# Altium schematic sheet Current_Meas.SchDoc
size A4
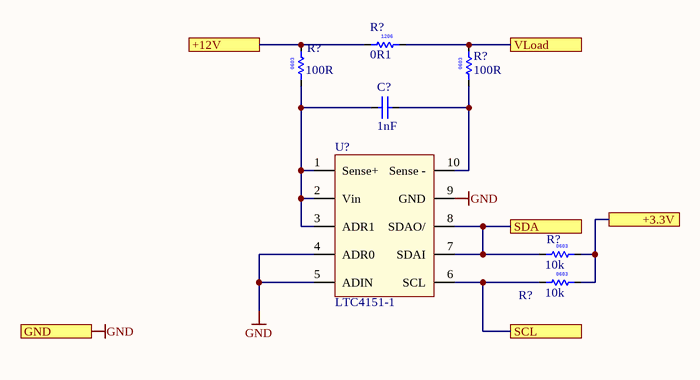
[diagram p0: Current_Meas.SchDoc]

## Parts
(Parts that share a designator on the sheet are numbered #1, #2 ... from top to bottom, then left to right.)
C?  1nF  [CAPC1608N]
R?#1  0R1  [RESC3216N]
R?#2  100R  [RESC1608N]
R?#3  100R  [RESC1608N]
R?#4  10k  [RESC1608N]
R?#5  10k  [RESC1608N]
U?  LTC4151-1  [MSOP_10]

## Ports
+3.3V, +12V, GND, SCL, SDA, VLoad

## Nets
GND: U?.4(ADR0) U?.5(ADIN) U?.9(GND) ; port GND
+3.3V: R?#4.2 R?#5.2 ; port +3.3V
+12V: R?#1.1 R?#2.2 ; port +12V
SCL: R?#5.1 U?.6(SCL) ; port SCL
SDA: R?#4.1 U?.7(SDAI) U?.8(SDAO/) ; port SDA
VLoad: R?#1.2 R?#3.2 ; port VLoad
NetC?_1: C?.1 R?#2.1 U?.1(Sense+) U?.2(Vin) U?.3(ADR1)
NetC?_2: C?.2 R?#3.1 U?.10(Sense_-)

## Notes on the sheet
- (in symbol R0000008) 0603
- (in symbol R0000023) 1206
- (in symbol R2406048) 0603

## Library data of the parts
C? = C0000004: MLCC, 1nF, 50V, 10%, X7R, 0603; Manufacturer: KEMET; Manufacturer Part Number: C0603C102K5RAC; Voltage: 50; Part Number: C0000004; Part Type: MLCC; Tolerance: 10%; Material: X7R; Package: 0603 (1608 metric); SMD: Yes; Supplier 1: Farnell; Supplier Part Number 1: 1414608RL; Data: 2011.01.26
R?#1 = R0000023: Res, 0.1R 1% 500mW 1206; Manufacturer: YAGEO (PHYCOMP); Manufacturer Part Number: RL1206FR-7W0R1L; R2408042: R0000023; Part type: Thick Film; Tolerance: ±1%; Power: 500mW; Package: 1206 (3216 metric); SMD: Yes; Supplier 1: Farnell; Supplier Part Number 1: 8067589; Price: 0,78; MOQ: 10; ComponentLink1Description: Datasheet MFG; ComponentLink1URL: http://www.farnell.com/datasheets/443194.pdf; Qty: 10; Data: 2011.03.07
R?#2 R?#3 = R2406048: Res, 100R 5% 0603 1/10W; Manufacturer: MULTICOMP; Manufacturer Part Number: MC 0.063W 0603 5% 100R; R2408042: R2406048; Part type: MC 0.063W 0603 5% 100R; Tolerance: ±5%; Power: 1/10W; Package: 0603 (1608 metric); SMD: Yes; Supplier 1: Farnell; Supplier Part Number 1: 9331689RL; Data: 2011.01.31
R?#4 R?#5 = R0000008: Res, 10K 0.063W 75V 1%  0603; Manufacturer: MULTICOMP; Manufacturer Part Number: MCMR06X1002FTL; Project: AUT-RX03-00; Note: 0,033 €; R2408042: R0000008; Part type: Thick Film; Tolerance: ±1%; Power: 0.063W; Package: 0603 (1608 metric); SMD: Yes; Supplier 1: Farnell; Supplier Part Number 1: 2073349; Supplier 2: Mouser; Supplier Part Number 2: 594-MCT06030C1002FP5; ComponentLink1Description: Datasheet MFG; ComponentLink1URL: http://www.vishay.com/doc?28705; Data: 2011.02.28
U? = LTC4151CMS-1#PBF: LINEAR TECHNOLOGY  LTC4151CMS-1#PBF  High Voltage I2C Current and Voltage Monitor, 7V-48Vin, MSOP-10; Supplier 1: Farnell; Supplier Part Number 1: 2295459